# Altium schematic sheet Motor Control.SchDoc
size A3; SheetNumber: 5; SheetTotal: 5
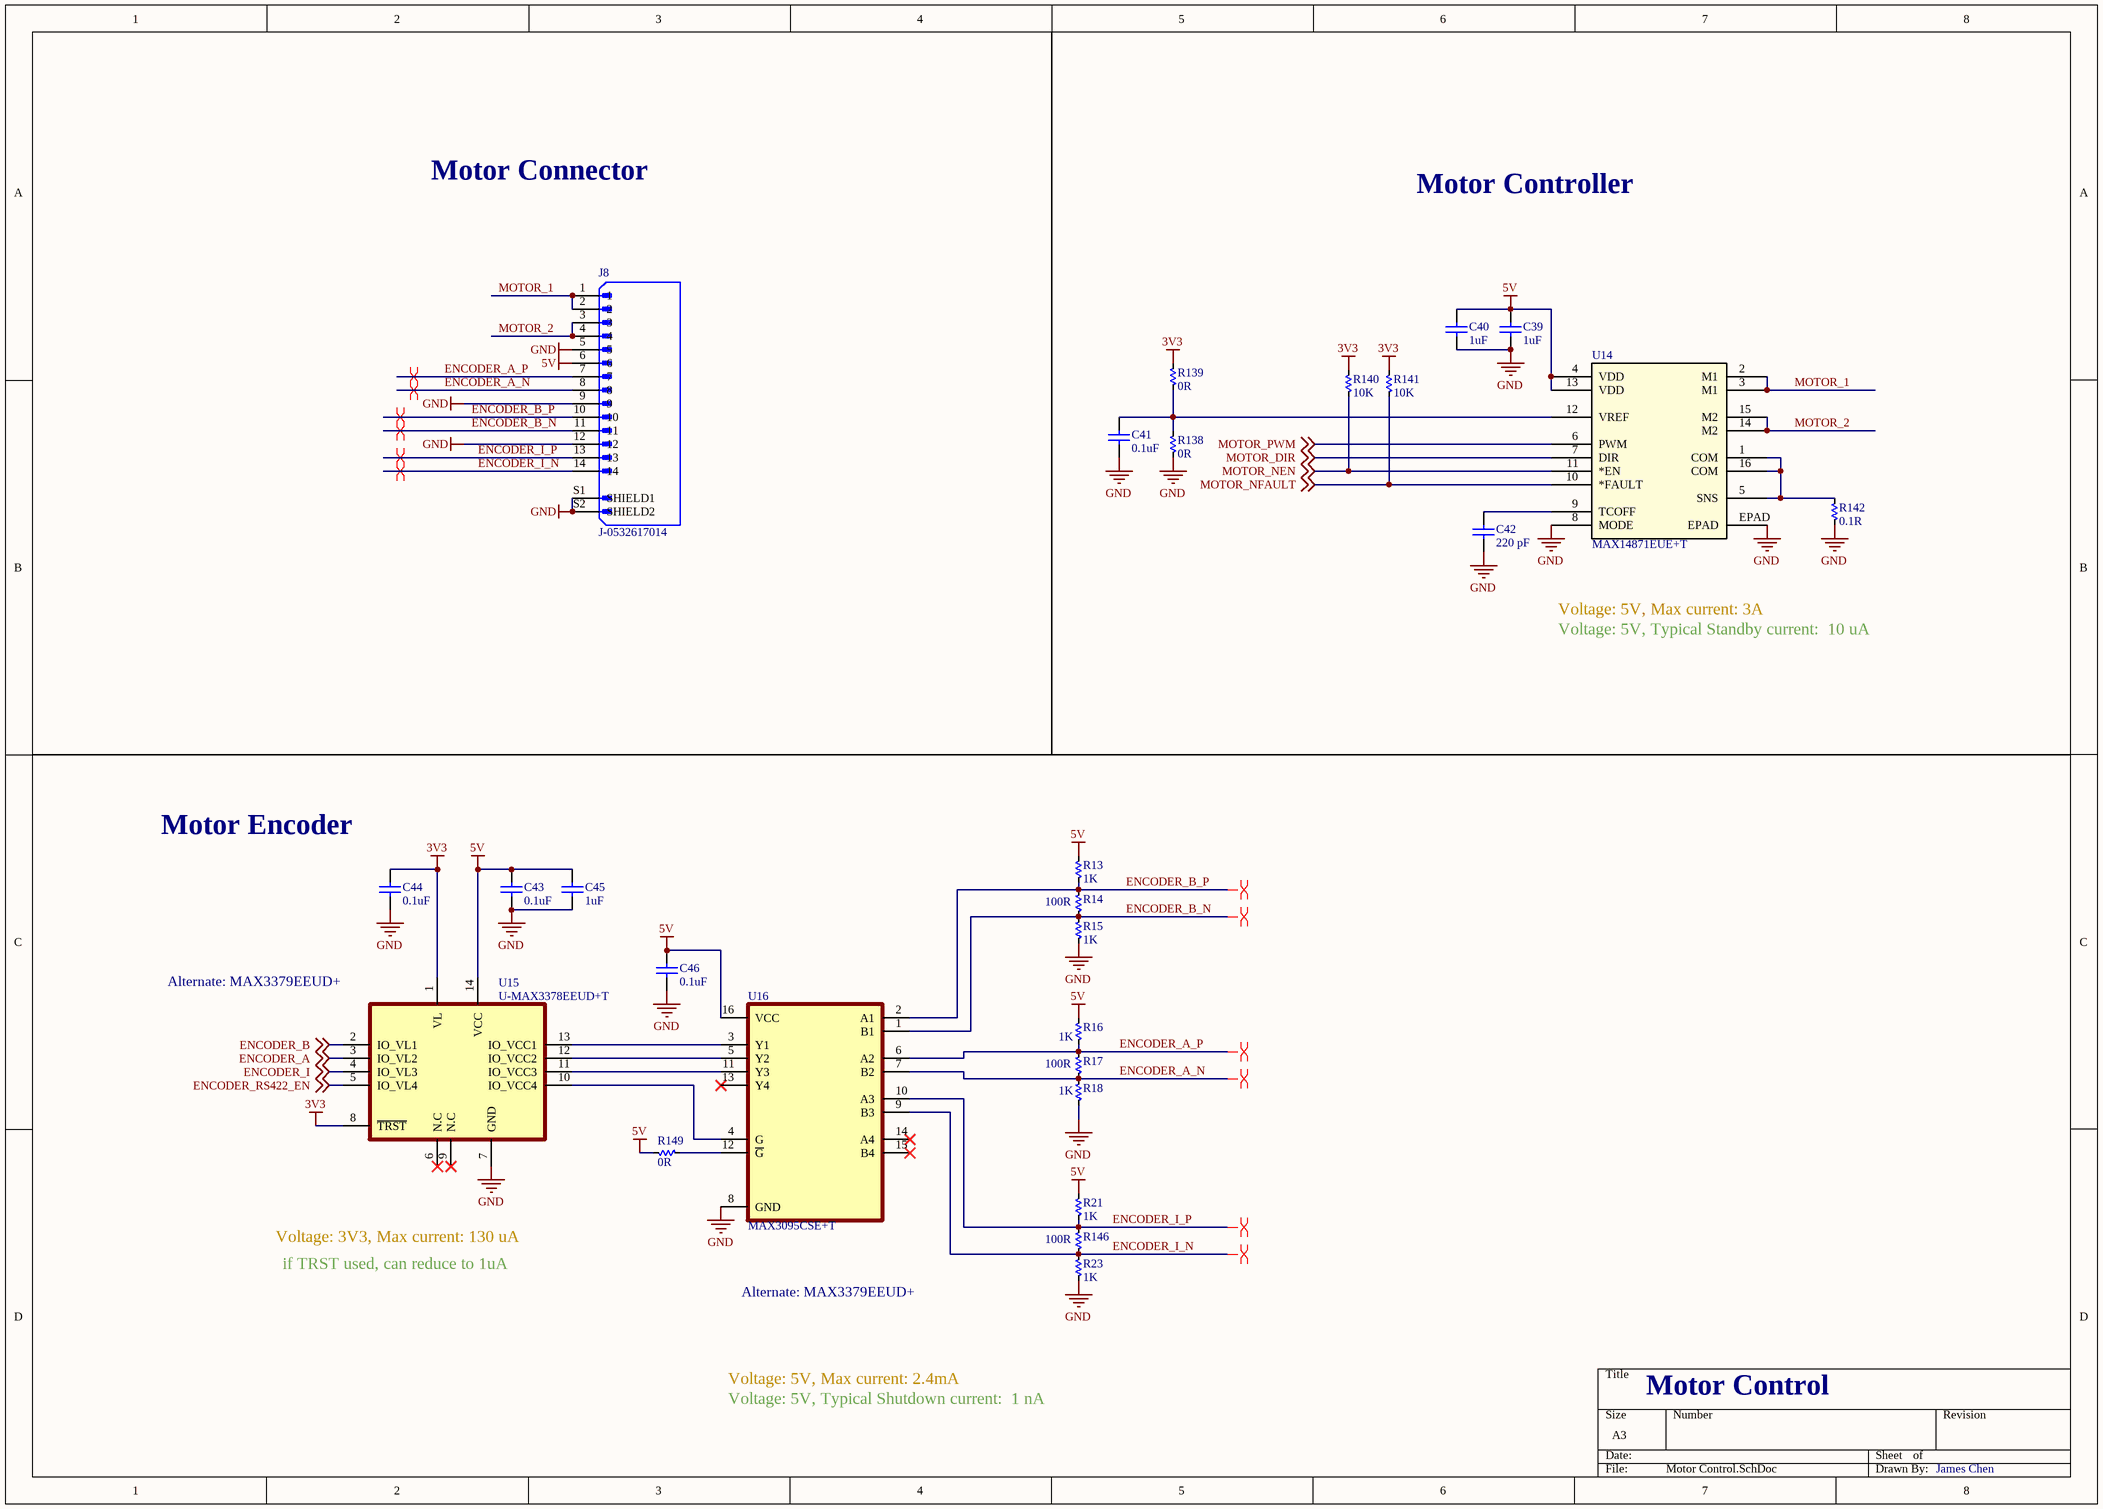
[diagram p0: Motor Control.SchDoc]

## Parts
C39  1uF  [0603]
C40  1uF  [0603]
C41  0.1uF  [0603]
C42  220 pF  [0603]
C43  0.1uF  [0603]
C44  0.1uF  [0603]
C45  1uF  [0603]
C46  0.1uF  [0603]
J8  J-0532617014  [J-532617014]
R13  1K  [0603]
R14  100R  [0603]
R15  1K  [0603]
R16  1K  [0603]
R17  100R  [0603]
R18  1K  [0603]
R21  1K  [0603]
R23  1K  [0603]
R138  0R  [0603]
R139  0R  [0603]
R140  10K  [0603]
R141  10K  [0603]
R142  0.1R  [2512]
R146  100R  [0603]
R149  0R  [0603]
U14  MAX14871EUE+T  [U-MAX14871EUE+T]
U15  U-MAX3378EEUD+T  [U-MAX3378EEUD+T]
U16  MAX3095CSE+T  [U-MAX3095CSE+T]

## Nets
3V3: C44.1 R139.2 R140.1 R141.1 U15.1(VL) U15.8(~{TRST})
5V: C39.1 C40.1 C43.1 C45.2 C46.1 J8.6 R13.2 R16.2 R21.2 R149.2 U14.4(VDD) U14.13(VDD) U15.14(VCC) U16.16(VCC)
GND: C39.2 C40.2 C41.2 C42.1 C43.2 C44.2 C45.1 C46.2 J8.5 J8.9 J8.12 J8.S1(SHIELD1) J8.S2(SHIELD2) R15.1 R18.1 R23.1 R138.2 R142.1 U14.8(MODE) U14.EPAD U15.7(GND) U16.8(GND)
ENCODER_A: U15.3(IO_VL2) ; off-sheet ENCODER_A
ENCODER_A_N: J8.8 R17.1 R18.2 U16.7(B2)
ENCODER_A_P: J8.7 R16.1 R17.2 U16.6(A2)
ENCODER_B: U15.2(IO_VL1) ; off-sheet ENCODER_B
ENCODER_B_N: J8.11 R14.1 R15.2 U16.1(B1)
ENCODER_B_P: J8.10 R13.1 R14.2 U16.2(A1)
ENCODER_I: U15.4(IO_VL3) ; off-sheet ENCODER_I
ENCODER_I_N: J8.14 R23.2 R146.1 U16.9(B3)
ENCODER_I_P: J8.13 R21.1 R146.2 U16.10(A3)
ENCODER_RS422_EN: U15.5(IO_VL4) ; off-sheet ENCODER_RS422_EN
MOTOR_1: J8.1 J8.2 U14.2(M1) U14.3(M1)
MOTOR_2: J8.3 J8.4 U14.14(M2) U14.15(M2)
MOTOR_DIR: U14.7(DIR) ; off-sheet MOTOR_DIR
MOTOR_NEN: R140.2 U14.11(*EN) ; off-sheet MOTOR_NEN
MOTOR_NFAULT: R141.2 U14.10(*FAULT) ; off-sheet MOTOR_NFAULT
MOTOR_PWM: U14.6(PWM) ; off-sheet MOTOR_PWM
NetC41_1: C41.1 R138.1 R139.1 U14.12(VREF)
NetC42_2: C42.2 U14.9(TCOFF)
NetR142_2: R142.2 U14.1(COM) U14.5(SNS) U14.16(COM)
NetR149_1: R149.1 U16.12(~{G})
NetU15_10: U15.10(IO_VCC4) U16.4(G)
NetU15_11: U15.11(IO_VCC3) U16.11(Y3)
NetU15_12: U15.12(IO_VCC2) U16.5(Y2)
NetU15_13: U15.13(IO_VCC1) U16.3(Y1)

Not connected (* = marked no-connect by the designer): U15 6(N.C)* 9(N.C)*; U16 13(Y4)* 14(A4)* 15(B4)*

## Layout directives
differential pair: ENCODER_A_N, ENCODER_A_P, ENCODER_B_N, ENCODER_B_P, ENCODER_I_N, ENCODER_I_P

## Notes on the sheet
- Motor Connector
- Motor Controller
- Voltage: 5V, Max current: 3A
- Voltage: 5V, Typical Standby current:  10 uA
- Motor Encoder
- (near U15) Alternate: MAX3379EEUD+
- Voltage: 3V3, Max current: 130 uA
- if TRST used, can reduce to 1uA
- Alternate: MAX3379EEUD+
- Voltage: 5V, Max current: 2.4mA
- Motor Control
- Voltage: 5V, Typical Shutdown current:  1 nA
- James Chen

## Library data of the parts
C39 C40 C45 = CC-105-K-25V-X7R-0603: CAP CER 1UF 25V X7R 0603; Manufacturer: Yageo; Manufacturer Part #: CC0603KRX7R8BB105; ComponentLink1Description: Datasheet; ComponentLink1URL: https://www.yageo.com/upload/media/product/productsearch/datasheet/mlcc/UPY-GPHC_X7R_6.3V-to-50V_18.pdf; ComponentLink2Description: Manufacture Website; ComponentLink2URL: https://www.yageo.com/en/Home; Distributor: Digikey; Distributor Part #: 311-1802-1-ND; Part Description: CAP CER 1UF 25V X7R 0603; SignalCraft Part #: CC-105-K-25V-X7R-0603; Value: 1uF
C41 C43 C44 C46 = CC-104-K-25V-X7R-0603: 0.1 µF ±10% 25V Ceramic Capacitor X7R 0603 (1608 Metric); Manufacturer: Samsung Electro-Mechanics; Manufacturer Part #: CL10B104KA8NNNC; ComponentLink1description: Datasheet; ComponentLink1URL: https://ds.yuden.co.jp/TYCOMPAS/ut/detail?pn=TMK105BJ104KV-F%20%20&u=M; ComponentLink2description: Manufacturer Website; Distributor: Digikey; Distributor Part #: 1276-1006-1-ND; Part Description: 0.1 µF ±10% 25V Ceramic Capacitor X7R 0603 (1608 Metric); ComponentLink2URL: https://www.yuden.co.jp/or/; Value: 0.1uF
C42 = CC-228-J-50V-C0G-0603: 15 pF ±1% 50V Ceramic Capacitor C0G, NP0 0201 (0603 Metric); Manufacturer: Samsung Electro-Mechanics; Manufacturer Part #: CL10C221JB8NNNC; ComponentLink1Description: Datasheet; ComponentLink1URL: *; ComponentLink2Description: Manufacture Website; ComponentLink2URL: *; Distributor: Digikey; Distributor Part #: 1276-1048-1-ND; Part Description: 15 pF ±1% 50V Ceramic Capacitor C0G, NP0 0201 (0603 Metric); Value: 220 pF
J8 = J-0532617014: Connector Header Surface Mount, Right Angle 14 position 0.049 (1.25mm); Manufacturer: Molex; Manufacturer Part #: 0532617014; Distributor: Digikey; Distributor Part #: 900-0532617014CT-ND; SnapEDA_Link: https://www.snapeda.com/parts/532617014/Molex/view-part/5064407/?ref=snap
R13 R15 R16 R18 R21 R23 = RT-1K0-F-1/16W-0603: RES SMD 1K OHM 1% 1/16W 0603; Manufacturer: TE Connectivity Passive Product; Manufacturer Part #: CPF0603F1K0C1; ComponentLink1description: Datasheet; ComponentLink1URL: https://www.vishay.com/docs/20035/dcrcwe3.pdf; ComponentLink2description: Manufacturer Website; Distributor: Digikey; Distributor Part #: A102226CT-ND; Part Description: RES SMD 1K OHM 1% 1/16W 0603; ComponentLink2URL: https://www.vishay.com/; Value: 1K
R14 R17 R146 = RT-100R-F-1/16W-0603: RES SMD 100 OHM 0.5% 1/16W 0603; Manufacturer: Susumu; Manufacturer Part #: RR08P100DCT-ND; Distributor: Digikey; Distributor Part #: RR08P100DCT-ND; Part Description: RES SMD 100 OHM 0.5% 1/16W 0603; Value: 100R
R138 R139 R149 = RT-0R00-F-1/10W-0603: 0 Ohms Jumper 0.1W, 1/10W Chip Resistor 0603 (1608 Metric) Automotive AEC-Q200 Thick Film; Manufacturer: Stackpole Electronics Inc; Manufacturer Part #: RMCF0603ZT0R00; ComponentLink1description: Datasheet; ComponentLink1URL: https://industrial.panasonic.com/ww/products/resistors/chip-resistors/general-purpose-chip-resistors/models/ERJ2GE0R00X; ComponentLink2description: Manufacturer Website; Distributor: Digikey; Distributor Part #: RMCF0603ZT0R00CT-ND; Part Description: 0 Ohms Jumper 0.1W, 1/10W Chip Resistor 0603 (1608 Metric) Automotive AEC-Q200 Thick Film; ComponentLink2URL: https://industrial.panasonic.com/ww/products/resistors/chip-resistors/general-purpose-chip-resistors/models/ERJ2GE0R00X; Value: 0R
R140 R141 = RT-10K0-F-1/16W-0603: 10 kOhms ±0.1% 0.063W, 1/16W Chip Resistor 0603 (1608 Metric) - Thin Film; Manufacturer: TE Connectivity Passive Product; Manufacturer Part #: CPF0603B10KE; ComponentLink1description: Datasheet; ComponentLink1URL: https://www.vishay.com/docs/20035/dcrcwe3.pdf; ComponentLink2description: Manufacturer Website; Distributor: Digikey; Distributor Part #: A119886CT-ND; Part Description: 10 kOhms ±0.1% 0.063W, 1/16W Chip Resistor 0603 (1608 Metric) - Thin Film; ComponentLink2URL: https://www.vishay.com/; Value: 10K
R142 = RT-0R1-3W-2512: RES 0.1 OHM 1% 3W 2512; Manufacturer: Bourns Inc.; Manufacturer Part #: CRA2512-FZ-R100ELF; ComponentLink1description: Datasheet; ComponentLink1URL: https://www.vishay.com/docs/20035/dcrcwe3.pdf; ComponentLink2description: Manufacturer Website; Distributor: Digikey; Distributor Part #: CRA2512-FZ-R100ELFCT-ND; Part Description: RES 0.1 OHM 1% 3W 2512; ComponentLink2URL: https://www.vishay.com/; Value: 0.1R
U14 = U-MAX14871EUE+T: IC MOTOR DRIVER 4.5V-36V 16TSSOP; Manufacturer: Maxim Integrated Products; Manufacturer Part #: MAX14871EUE+T; Distributor Part #: MAX14871EUE+CT-ND; Distributor: Digikey
U15 = U-MAX3378EEUD+T: IC TRNSLTR BIDIRECTIONAL 14TSSOP; Manufacturer: Maxim Integrated; Manufacturer Part #: MAX3378EEUD+T; Distributor: Digikey; Distributor Part #: MAX3378EEUD+TCT-ND
U16 = U-MAX3095CSE+T: IC RECEIVER 0/4 16SO; Manufacturer: Maxim Integrated; Distributor Part #: MAX3095CSE+TCT-ND; Distributor: Digikey; Manufacturer Part #: MAX3095CSE+T